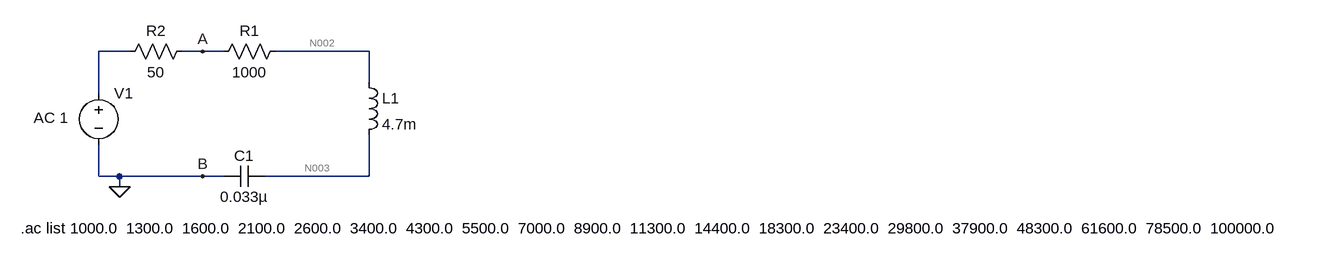
[diagram p0: schematic series.asc]
series.asc, the LTspice schematic file:
Version 4
SHEET 1 4808 680
WIRE 48 64 0 64
WIRE 160 64 128 64
WIRE 192 64 160 64
WIRE 416 64 272 64
WIRE 416 112 416 64
WIRE 0 128 0 64
WIRE 0 256 0 208
WIRE 32 256 0 256
WIRE 160 256 32 256
WIRE 192 256 160 256
WIRE 416 256 416 192
WIRE 416 256 256 256
WIRE 32 272 32 256
FLAG 160 64 A
FLAG 160 256 B
FLAG 32 272 0
SYMBOL voltage 0 112 R0
WINDOW 3 -100 54 Left 2
WINDOW 123 0 0 Left 0
WINDOW 39 0 0 Left 0
SYMATTR InstName V1
SYMATTR Value AC 1
SYMBOL res 288 48 R90
WINDOW 0 0 56 VBottom 2
WINDOW 3 32 56 VTop 2
SYMATTR InstName R1
SYMATTR Value 1000
SYMBOL ind 400 96 R0
SYMATTR InstName L1
SYMATTR Value 4.7m
SYMBOL cap 256 240 R90
WINDOW 0 0 32 VBottom 2
WINDOW 3 32 32 VTop 2
SYMATTR InstName C1
SYMATTR Value 0.033µ
SYMBOL res 144 48 R90
WINDOW 0 0 56 VBottom 2
WINDOW 3 32 56 VTop 2
SYMATTR InstName R2
SYMATTR Value 50
TEXT -120 336 Left 2 !.ac list 1000.0  1300.0  1600.0  2100.0  2600.0  3400.0  4300.0  5500.0  7000.0  8900.0  11300.0  14400.0  18300.0  23400.0  29800.0  37900.0  48300.0  61600.0  78500.0  100000.0

The netlist it stands for:
* series.asc
V1 N001 0 AC 1
R1 N002 A 1000
L1 N002 N003 4.7m
C1 N003 0 0.033µ
R2 A N001 50
.ac list 1000.0  1300.0  1600.0  2100.0  2600.0  3400.0  4300.0  5500.0  7000.0  8900.0  11300.0  14400.0  18300.0  23400.0  29800.0  37900.0  48300.0  61600.0  78500.0  100000.0
.backanno
.end

* Results of the author's LTspice run, read from the files saved beside the schematic
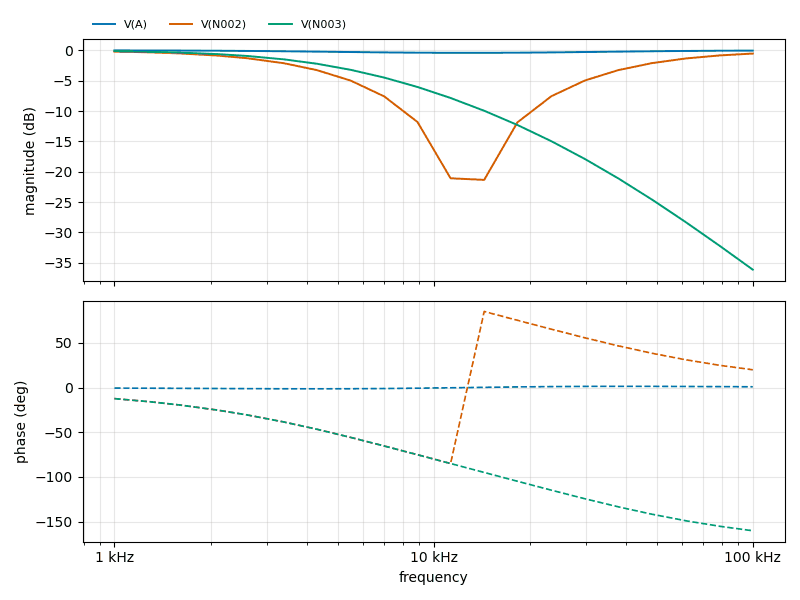
[diagram p1: AC Analysis of series.asc, plotted from the saved traces]
* AC Analysis, 1 run:
*   V(A): -0.02 dB at 1 kHz, -0.05 dB at 100 kHz, peak -0.02 dB at 1 kHz
*   V(N002): -0.20 dB at 1 kHz, -0.53 dB at 100 kHz, peak -0.20 dB at 1 kHz, 3 dB below the peak at 4.266 kHz
*   V(N003): -0.15 dB at 1 kHz, -36.13 dB at 100 kHz, peak -0.15 dB at 1 kHz, 3 dB below the peak at 5.424 kHz